# EAGLE design iv-11_boost_supply (EAGLE 7.1.0)
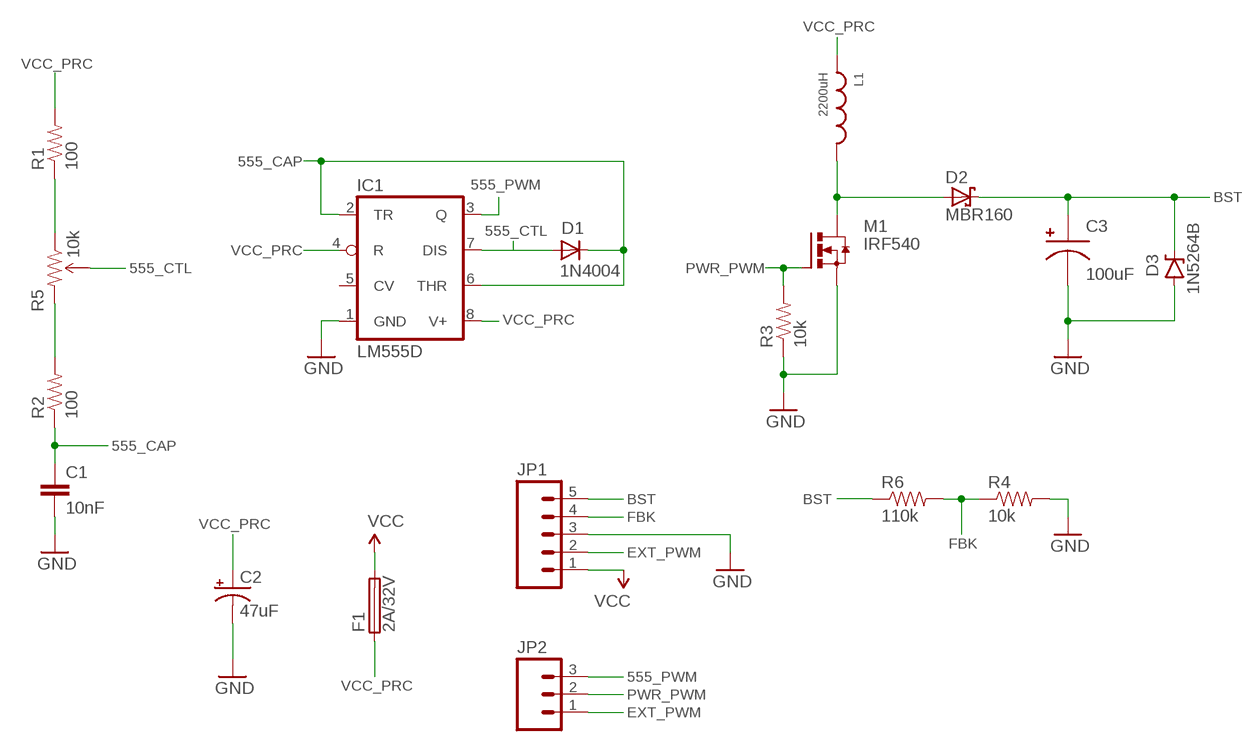
[diagram p0: schematic, sheet 1]

## Parts
C1  10nF  CAP1206  [1206]
C2  47uF  CAP_POLPTH1  [CPOL-RADIAL-100UF-25V]
C3  100uF  POLAR-CAP  [POLAR-CAP-PTH-10MM]
D1  1N4004  [DO41-10]
D2  MBR160  SCHOTTKY-DIODEDO41  [DO41-10]
D3  1N5264B  DIODE-ZENERPTH  [DIODE-ZENER]
F1  2A/32V  1AG-1/4X5/8-FUSE  [1AG-1/4X5/8-FUSE]
IC1  LM555D  [SO08]
JP1  M05LOCK  [1X05_LOCK]
JP2  M03LOCK  [1X03_LOCK]
L1  2200uH  INDUCTOR  [INDUCTOR-PTH-13MM]
M1  IRF540  IRF540NPBF  [D2PACK]
R1  100  RESISTOR1206  [1206]
R2  100  RESISTOR1206  [1206]
R3  10k  RESISTOR1206  [1206]
R4  10k  RESISTOR1206  [1206]
R5  10k  TRIMPOT  [TRIMPOT-5MM-V2]
R6  110k  RESISTOR1206  [1206]

## Nets
555_CAP: C1.1 D1.C IC1.2(TR) IC1.6(THR) R2.1
555_CTL: D1.A IC1.7(DIS) R5.B(WIPER)
555_PWM: IC1.3(Q) JP2.3
BST: C3.A D2.C D3.P$1(C) JP1.5 R6.1
EXT_PWM: JP1.2 JP2.1
FBK: JP1.4 R4.1 R6.2
GND: C1.2 C2.2(-) C3.B D3.P$2(A) IC1.1(GND) JP1.3 M1.3(S) R3.1 R4.2
N$1: R1.1 R5.A(CCW)
N$2: R2.2 R5.C(CW)
N$4: D2.A L1.B M1.2(D)
PWR_PWM: JP2.2 M1.1(G) R3.2
VCC: F1.P$3 F1.P$4 JP1.1
VCC_PRC: C2.1(+) F1.P$1 F1.P$2 IC1.4(R) IC1.8(V+) L1.A R1.2
Unconnected: IC1.5(CV)

## Library data of the parts
C1 = SparkFun-Passives:CAP: Capacitor Standard 0603 ceramic capacitor, and 0.1" leaded capacitor.
C2 = SparkFun-Passives:CAP_POL: Capacitor Polarized These are standard SMD and PTH capacitors. Normally 10uF, 47uF, and 100uF in electrolytic and tantalum varieties. Always verify the external diameter of the through hole cap, it varies with capacity, voltage, and manufacturer. The EIA devices should be standard.
C3 = boztalay:POLAR-CAP
D1 = adafruit:1N4004: DIODE General purpose 1N400x type rectifier (With bigger pads) http://www.ladyada.net/library/pcb/eaglelibrary.html
D2 = adafruit:SCHOTTKY-DIODE: Schottky Diode
D3 = SparkFun-DiscreteSemi:DIODE-ZENER: Zener Diode Production Part - 8199 3.4V Zener Voltage
F1 = boztalay:1AG-1/4X5/8-FUSE
IC1 = adafruit:*555: TIMER Changed DIP package to have round (not oval) pin pads http://www.ladyada.net/library/pcb/eaglelibrary.html
JP1 = SparkFun-Connectors:M05: Header 5 Standard 5-pin 0.1" header. Use with straight break away headers (SKU : PRT-00116), right angle break away headers (PRT-00553), swiss pins (PRT-00743), machine pins (PRT-00117), and female headers (PRT-00115). Molex polarized connector foot print use with SKU : PRT-08230 with associated crimp pins and housings.
JP2 = SparkFun-Connectors:M03: Header 3 Standard 3-pin 0.1" header. Use with straight break away headers (SKU : PRT-00116), right angle break away headers (PRT-00553), swiss pins (PRT-00743), machine pins (PRT-00117), and female headers (PRT-00115). Molex polarized connector foot print use with SKU : PRT-08232 with associated crimp pins and housings.
L1 = boztalay:INDUCTOR
M1 = boztalay:IRF540NPBF
R1-R4 R6 = SparkFun-Passives:RESISTOR: Resistor Basic schematic elements and footprints for 0603, 1206, and PTH resistors.
R5 = SparkFun-Electromechanical:TRIMPOT: Various small potentiometers for "set-and-forget" applications

## Board
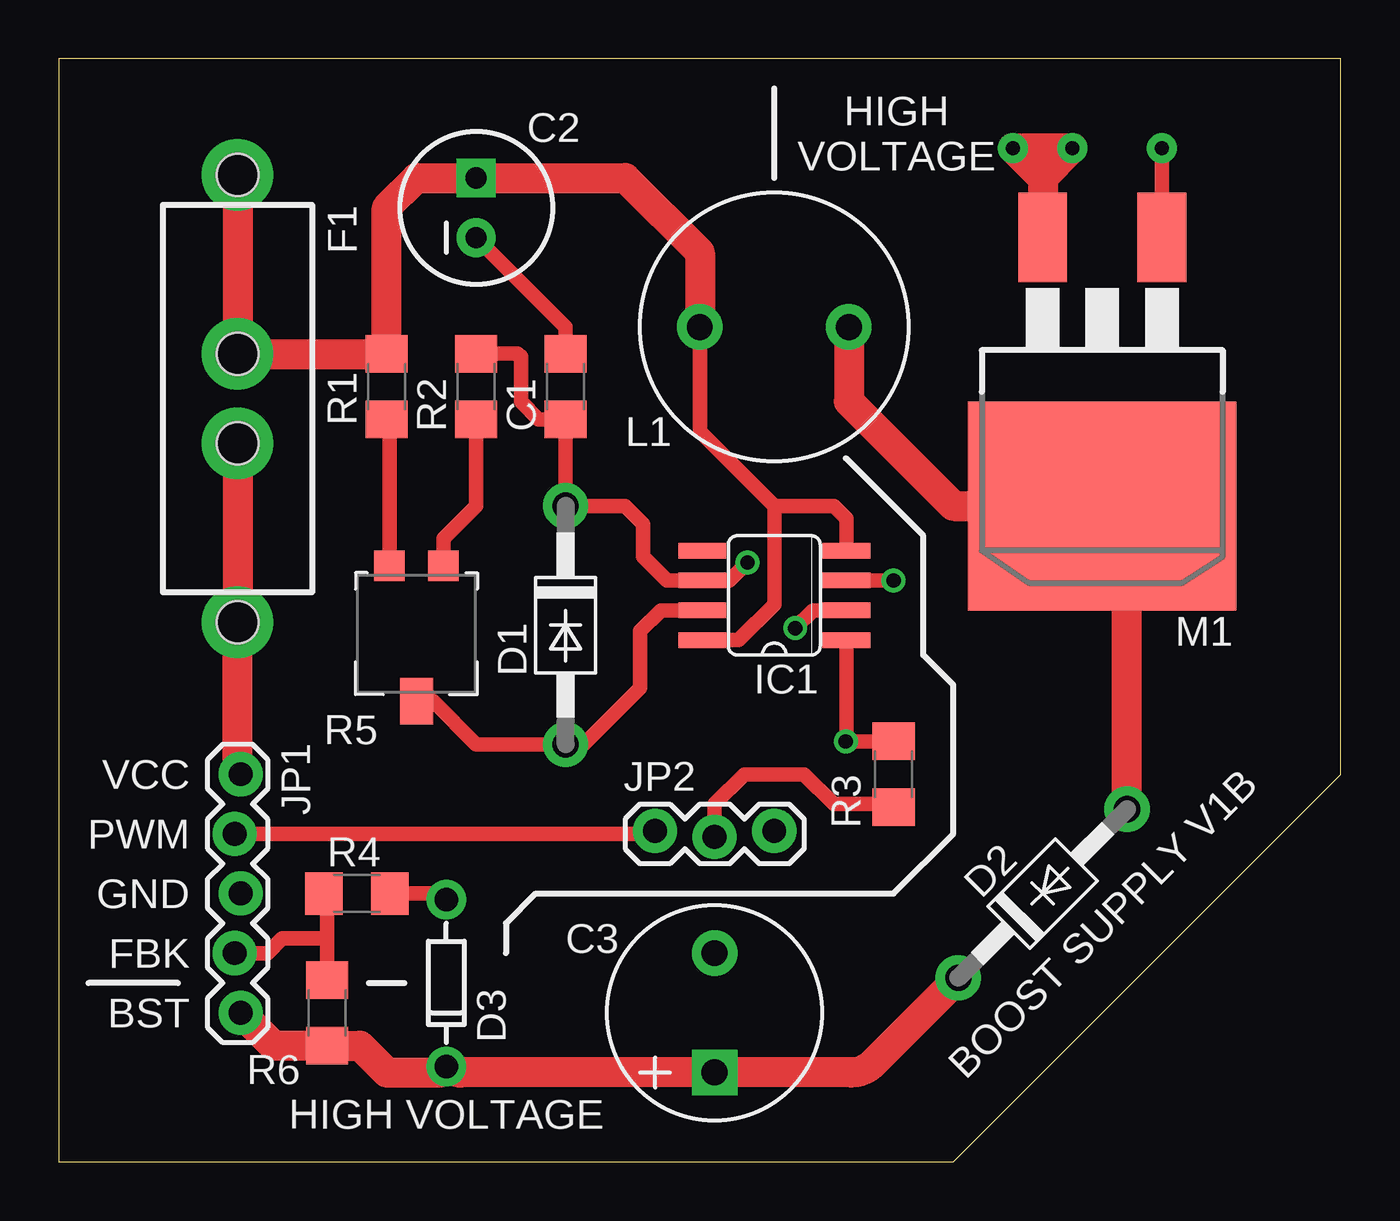
[diagram p1: board, top side]
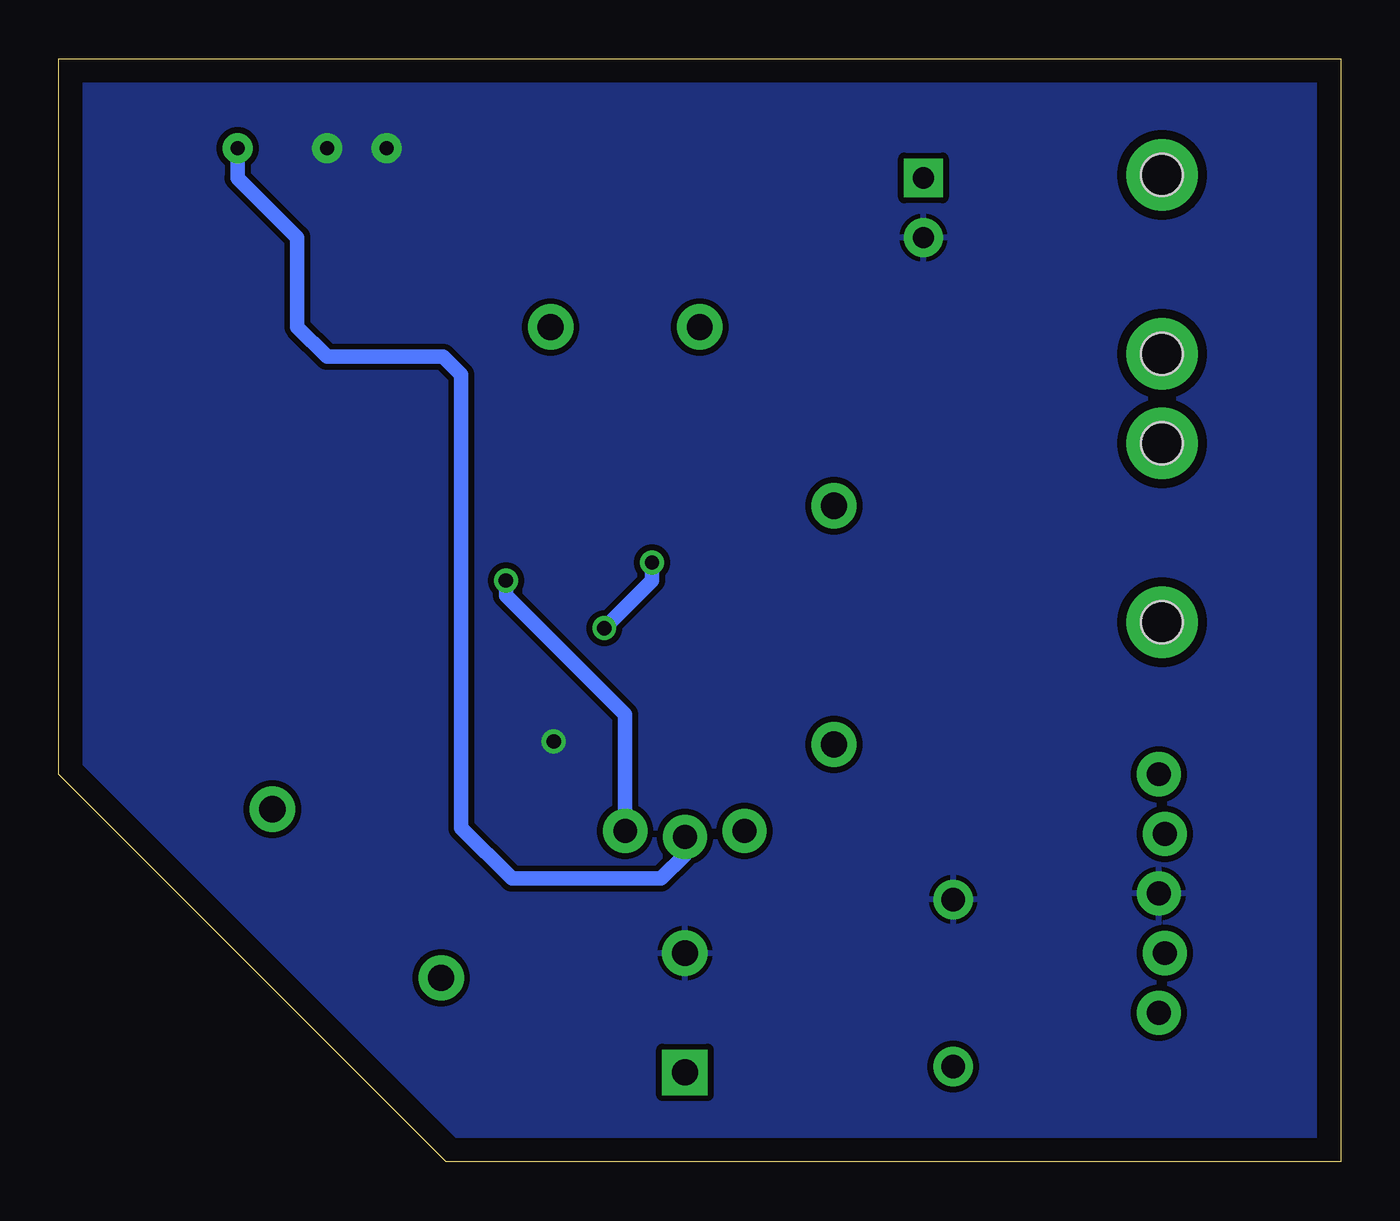
[diagram p2: board, bottom side, seen from below]

Size 54.61 x 46.99 mm. Coordinates in mm from the lower left corner, seen from the top.
Outline: 54.61,46.99 0,46.99 0,0 38.1,0 54.61,16.51 54.61,46.99
Copper layers (1*16): Top 0.035mm / dielectric 1.5mm / Bottom 0.035mm
Design rules "default *": minimum track width 10mil, minimum drill 24mil, track to track 10mil, track to pad 10mil, pad to pad 10mil, via to via 10mil, smd to smd 10mil, copper to edge 40mil, drill to drill 8mil, minimum pad ring 10mil, minimum via ring 8mil, stop-mask expansion 4mil, vias tented up to drill 0mil, thermal gap 8mil

### Footprints (pad centres in the part's own frame; a part is rotated, then mirrored left to right if it is on the bottom)
1206 = smd 1.6 x 1.8: 1 -1.4,0; 2 1.4,0
CPOL-RADIAL-100UF-25V = drill 0.9 pad 1.651 square: 1 1.27,0 | drill 0.9 pad 1.651: 2 -1.27,0
POLAR-CAP-PTH-10MM = drill 1.1 pad 1.93 square: A -2.54,0 | drill 1.1 pad 1.93: B 2.54,0
DO41-10 = drill 1.118 pad 1.93: A 5.08,0; C -5.08,0
DIODE-ZENER = drill 1 pad 1.676: P$1 -3.556,0; P$2 3.556,0
1AG-1/4X5/8-FUSE = drill 1.778 pad 3.048: P$1 -9.525,0; P$2 -1.905,0; P$3 1.905,0; P$4 9.525,0 | hole 1.778: -9.525,0; -1.905,0; 1.905,0; 9.525,0
SO08 = smd 0.66 x 2.032: 1 -1.905,-3.073; 2 -0.635,-3.073; 3 0.635,-3.073; 4 1.905,-3.073; 5 1.905,3.073; 6 0.635,3.073; 7 -0.635,3.073; 8 -1.905,3.073
1X05_LOCK = drill 1.016 pad 1.88: 1 0,0.127; 2 2.54,-0.127; 3 5.08,0.127; 4 7.62,-0.127; 5 10.16,0.127
1X03_LOCK = drill 1.016 pad 1.88: 1 0,0.127; 2 2.54,-0.127; 3 5.08,0.127
INDUCTOR-PTH-13MM = drill 1.1 pad 1.93: A -3.175,0; B 3.175,0
D2PACK = smd 2.083 x 3.81: 1 -2.54,-8.89; 3 2.54,-8.89 | smd 11.43 x 8.89: 2 0,2.54
TRIMPOT-5MM-V2 = smd 1.3 x 1.3: A 1.15,-2.54; C -1.15,-2.54 | smd 1.402 x 2: B 0,3.239

### Placement (x,y rotation side)
C1  21.59,33.02 90 top
C2  17.78,40.64 90 top
C3  27.94,6.35 90 top
D1  21.59,22.86 270 top
D2  41.91,11.43 45 top
D3  16.51,7.62 90 top
F1  7.62,32.51 270 top
IC1  30.48,24.13 90 top
JP1  7.62,16.51 270 top
JP2  25.4,13.97 0 top
L1  30.48,35.56 0 top
M1  44.45,30.48 180 top
R1  13.97,33.02 90 top
R2  17.78,33.02 270 top
R3  35.56,16.51 270 top
R4  12.7,11.43 0 top
R5  15.24,22.86 180 top
R6  11.43,6.35 90 top

### Tracks (layer width: path | path; a pad name or v marks a point on that pad's centre or on a via)
555_CAP  (via drill 0.61)
  Top 0.61: R2.1 19.55,34.42 19.68,34.29 19.68,32.38 20.45,31.62 C1.1 D1.C 24.13,27.94 24.89,27.18 24.89,25.78 25.91,24.77 IC1.6 28.57,24.77 v29.34,25.53 | IC1.2 32.13,23.5 v31.37,22.73
  Bottom 0.61: v29.34,25.53 29.34,24.77 v31.37,22.73
555_CTL
  Top 0.61: R5.B 15.94,19.62 17.78,17.78 D1.A 22.35,17.78 24.77,20.19 24.77,22.61 25.65,23.5 IC1.7
555_PWM  (via drill 0.61)
  Top 0.61: IC1.3 v35.56,24.77
  Bottom 0.61: v35.56,24.77 35.56,24.13 30.48,19.05 JP2.3
BST
  Top 1.27: JP1.5 9.15,4.95 R6.1 12.83,4.95 13.97,3.81 16.26,3.81 D3.P$1 arc45 17.12,3.81 C3.A 33.76,3.81 arc45 34.66,4.18 D2.C
EXT_PWM
  Top 0.61: JP1.2 25.27,13.97 JP2.1
FBK
  Top 0.61: 11.43,7.62 R6.2 11.43,9.65 | 11.43,9.65 11.43,11.3 R4.1 | JP1.4 8.89,8.89 9.53,9.53 11.3,9.53 11.43,9.65
GND  (via drill 0.61, 0.61 pad 1.27)
  Top 0.61: C1.2 21.59,35.56 C2.2 | R4.2 16.26,11.43 D3.P$2 | IC1.1 33.55,17.93 v33.53,17.91 R3.1
  Top 1.27: 41.91,41.91 v43.18,43.18 v40.64,43.18 41.91,41.91 | 41.91,41.91 M1.3
  pour Bottom: 0,0 38.1,0 54.61,16.51 54.61,46.99 0,46.99
N$1
  Top 0.61: R5.A 14.09,31.5 R1.1
N$2
  Top 0.61: R5.C 16.39,26.55 17.78,27.94 R2.2
N$4
  Top 1.27: 44.6,27.79 M1.2 | M1.2 38.1,27.94 33.66,32.38 L1.B | D2.A 45.5,26.36 arc45 45.13,27.26 M1.2
PWR_PWM  (via drill 0.61 pad 1.27)
  Top 0.61: R3.2 35.43,15.24 33.02,15.24 31.75,16.51 29.21,16.51 27.94,15.24 JP2.2 | M1.1 v46.99,43.18
  Bottom 0.61: v46.99,43.18 46.99,41.91 44.45,39.37 44.45,35.56 43.18,34.29 38.23,34.29 37.47,33.53 37.47,14.22 35.31,12.06 28.96,12.06 27.94,13.08 JP2.2
VCC
  Top 1.27: JP1.1 7.62,16.51 F1.P$4 F1.P$3
VCC_PRC
  Top 0.61: 30.48,27.94 33.02,27.94 33.55,27.41 IC1.4 | 30.48,27.94 30.48,23.75 28.96,22.23 IC1.8 | L1.A 27.3,31.11 30.48,27.94
  Top 1.016: R1.2
  Top 1.27: F1.P$1 F1.P$2 R1.2 | R1.2 13.97,40.64 15.24,41.91 C2.1 24.13,41.91 27.3,38.73 L1.A

### Text on the board
tPlace: HIGH / VOLTAGE | VCC | PWM | GND | BOOST SUPPLY V1B | FBK | BST | HIGH VOLTAGE